# EAGLE design Avionica (EAGLE 9.6.2)
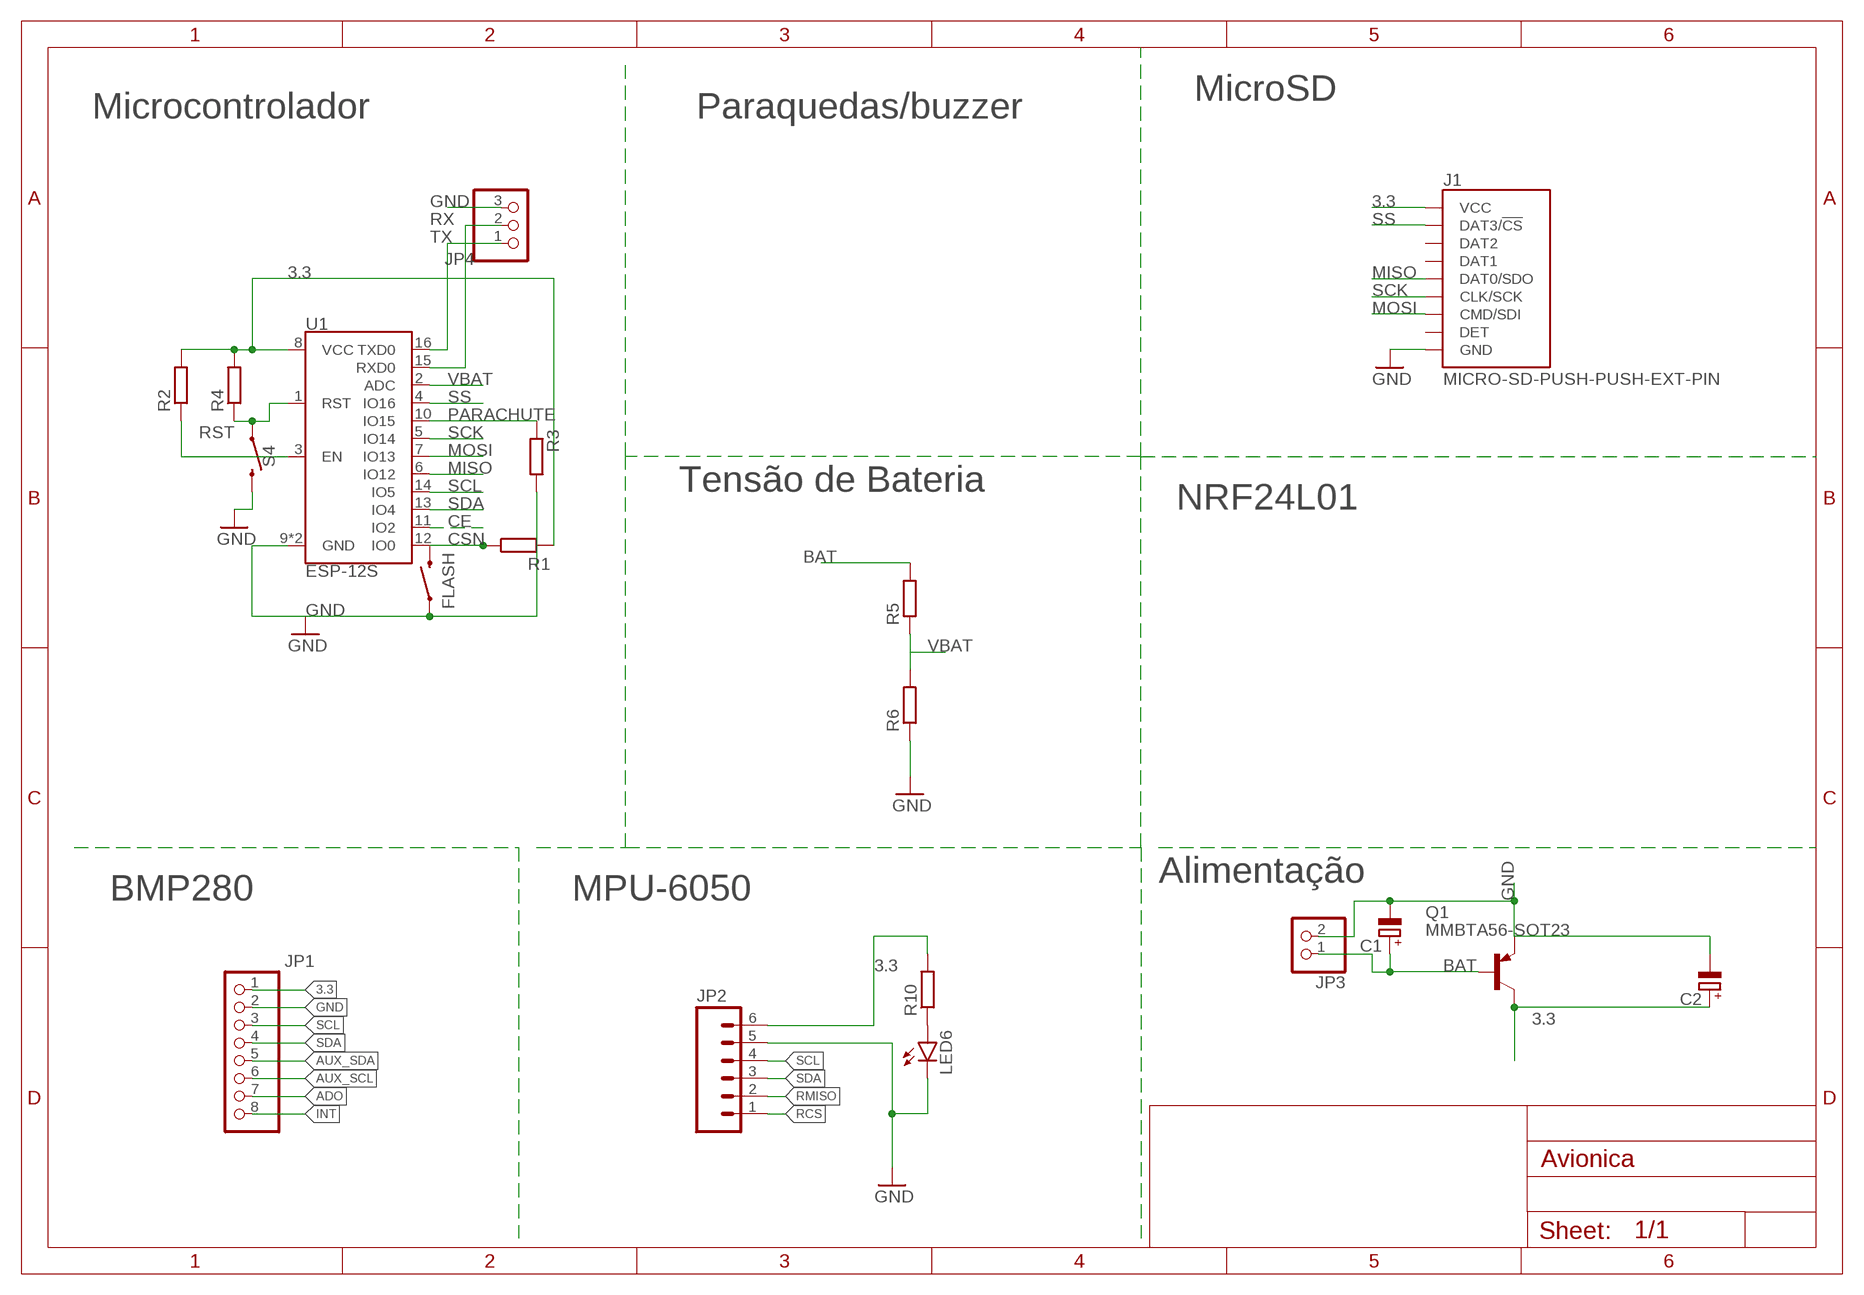
[diagram p0: schematic, sheet 1]

## Parts
C1  CPOL-EUE1.8-4  [E1,8-4]
C2  CPOL-EUE1.8-4  [E1,8-4]
FLASH  MOMENTARY-SWITCH-SPST-SMD-5.2MM-TALL  [TACTILE_SWITCH_SMD_5.2MM]
J1  MICRO-SD-PUSH-PUSH-EXT-PIN  [MICROSD-EXTERNALPIN]
JP1  PINHD-1X8  [1X08]
JP2  M06NO_SILK_FEMALE_PTH  [1X06_NO_SILK]
JP3  PINHD-1X2  [1X02]
JP4  PINHD-1X3  [1X03]
LED6  LEDCHIP-LED0805  [CHIP-LED0805]
Q1  MMBTA56-SOT23  [SOT23]
R1  R-EU_R0805W  [R0805W]
R2  R-EU_R0805W  [R0805W]
R3  R-EU_R0805W  [R0805W]
R4  R-EU_R0805W  [R0805W]
R5  R-EU_M0805  [M0805]
R6  R-EU_M0805  [M0805]
R10  R-EU_M0805  [M0805]
S4  MOMENTARY-SWITCH-SPST-SMD-5.2MM-TALL  [TACTILE_SWITCH_SMD_5.2MM]
U1  ESP-12S  [ESP-12S]

## Nets
3.3: C2.+ J1.4(VCC) JP1.1 JP2.6 Q1.3(C) R1.2 R2.2 R4.2 R10.2 U1.8(VCC)
ADO: JP1.7
AUX_SCL: JP1.6
AUX_SDA: JP1.5
BAT: C1.+ JP3.1 Q1.1(B) R5.2
CE: U1.11(IO2)
CSN: FLASH.3 R1.1 U1.12(IO0)
EN: R2.1 U1.3(EN)
GND: C1.- C2.- FLASH.1 J1.6(GND) J1.10(GND) J1.11(GND) J1.12(GND) J1.13(GND) JP1.2 JP2.5 JP3.2 JP4.3 LED6.C Q1.2(E) R3.2 R6.1 S4.3 U1.9(GND) U1.P$1(GND)
INT: JP1.8
MISO: J1.7(DAT0/SDO) U1.6(IO12)
MOSI: J1.3(CMD/SDI) U1.7(IO13)
N$16: LED6.A R10.1
PARACHUTE: R3.1 U1.10(IO15)
RCS: JP2.1
RMISO: JP2.2
RST: R4.1 S4.1 U1.1(RST)
RX: JP4.2 U1.15(RXD0)
SCK: J1.5(CLK/SCK) U1.5(IO14)
SCL: JP1.3 JP2.4 U1.14(IO5)
SDA: JP1.4 JP2.3 U1.13(IO4)
SS: J1.2(DAT3/!CS!) U1.4(IO16)
TX: JP4.1 U1.16(TXD0)
VBAT: R5.1 R6.2 U1.2(ADC)
Unconnected: J1.1(DAT2) J1.8(DAT1) J1.9(DET)

## Notes on the sheet
- MicroSD
- Microcontrolador | Paraquedas/buzzer
- Tensão de Bateria
- NRF24L01
- Alimentação
- BMP280 | MPU-6050

## Library data of the parts
C1 C2 = rcl:CPOL-EU: POLARIZED CAPACITOR, European symbol; SPICEPREFIX: C
FLASH S4 = SparkFun-Switches:MOMENTARY-SWITCH-SPST: Momentary Switch (Pushbutton) - SPST Normally-open (NO) SPST momentary switches (buttons, pushbuttons). Variants PTH-12MM - 12mm square, through-hole Momentary Pushbutton Switch - 12mm Square <https://www.sparkfun.com/products/9190> (COM-09190) PTH-6.0MM, PTH-6.0MM-KIT - 6.0mm square, through-hole Mini Pushbutton Switch <https://www.sparkfun.com/products/97> (COM-00097) KIT package intended for soldering kit's - only one side of pads' copper is exposed. PTH-RIGHT-ANGLE-KIT - Right-angle, through-hole Right Angle Tactile Button <https://www.sparkfun.com/products/10791> - Used on SparkFun BigTime Watch Kit <https://www.sparkfun.com/products/11734> SMD-12MM - 12mm square, surface-mount Tactile Button - SMD (12mm) <https://www.sparkfun.com/products/12993> (COM-12993) Used on SparkFun PicoBoard <https://www.sparkfun.com/products/11888> SMD-4.5MM - 4.5mm Square Trackball Switch Used on SparkFun Blackberry Trackballer Breakout <https://www.sparkfun.com/products/13169> SMD-4.6MMX2.8MM - 4.60mm x 2.80mm, surface mount Used on SparkFun Pro Micro - RP2040 <https://www.sparkfun.com/products/17717> SMD-5.2MM, SMD-5.2-REDUNDANT - 5.2mm square, surface-mount Mini Pushbutton Switch - SMD <https://www.sparkfun.com/products/8720> (COM-08720) Used on Arduino Pro Mini <https://www.sparkfun.com/products/11114> REDUNDANT package connects both switch circuits together SMD-6.0X3.5MM - 6.0 x 3.5mm, surface mount Momentary Reset Switch SMD <https://www.sparkfun.com/products/8229> (COM-08229) SMD-6.2MM-TALL - 6.2mm square, surface mount Tactile Button - SMD (6mm) <https://www.sparkfun.com/products/12992> Used on SparkFun Digital Sandbox <https://www.sparkfun.com/products/12651> SMD-RIGHT-ANGLE - Right-angle, surface mount Used on SparkFun Block for Intel® Edison - Arduino <https://www.sparkfun.com/products/13036>; PROD_ID: SWCH-14139
J1 = SparkFun-Connectors:MICRO-SD: microSD Socket for Transflash Various sockets for µSD. tDoc lines correctly indicate media card edge positions when inserting (unlocked, locked, depressed). NOTE: CD1 and CD2 are connected internally, and the default detect state of the socket is detect pin to ground. SparkFun Products: WAV Trigger <https://www.sparkfun.com/products/13660> CAN-Bus Shield <https://www.sparkfun.com/products/13262> SparkFun Level Shifing microSD Breakout <https://www.sparkfun.com/products/13743>; PROD_ID: CONN-16110
JP1 = pinhead:PINHD-1X8: PIN HEADER
JP2 = SparkFun-Connectors:M06: Header 6 Standard 6-pin 0.1" header. Use with straight break away headers (SKU : PRT-00116), right angle break away headers (PRT-00553), swiss pins (PRT-00743), machine pins (PRT-00117), and female headers (PRT-00115). Molex polarized connector foot print use with SKU : PRT-08094 with associated crimp pins and housings. NOTES ON THE VARIANTS LOCK and LOCK_LONGPADS... This footprint was designed to help hold the alignment of a through-hole component (i.e. 6-pin header) while soldering it into place. You may notice that each hole has been shifted either up or down by 0.005 of an inch from it's more standard position (which is a perfectly straight line). This slight alteration caused the pins (the squares in the middle) to touch the edges of the holes. Because they are alternating, it causes a "brace" to hold the component in place. 0.005 has proven to be the perfect amount of "off-center" position when using our standard breakaway headers. Although looks a little odd when you look at the bare footprint, once you have a header in there, the alteration is very hard to notice. Also,if you push a header all the way into place, it is covered up entirely on the bottom side. This idea of altering the position of holes to aid alignment will be further integrated into the Sparkfun Library for other footprints. It can help hold any component with 3 or more connection pins.; PROD_ID: CONN-08437
JP3 = pinhead:PINHD-1X2: PIN HEADER
JP4 = pinhead:PINHD-1X3: PIN HEADER
LED6 = led:LED: LED OSRAM: - CHIPLED LG R971, LG N971, LY N971, LG Q971, LY Q971, LO R971, LY R971 LH N974, LH R974 LS Q976, LO Q976, LY Q976 LO Q996 - Hyper CHIPLED LW Q18S LB Q993, LB Q99A, LB R99A - SideLED LS A670, LO A670, LY A670, LG A670, LP A670 LB A673, LV A673, LT A673, LW A673 LH A674 LY A675 LS A676, LA A676, LO A676, LY A676, LW A676 LS A679, LY A679, LG A679 - Hyper Micro SIDELED® LS Y876, LA Y876, LO Y876, LY Y876 LT Y87S - SmartLED LW L88C, LW L88S LB L89C, LB L89S, LG L890 LS L89K, LO L89K, LY L89K LS L896, LA L896, LO L896, LY L896 - TOPLED LS T670, LO T670, LY T670, LG T670, LP T670 LSG T670, LSP T670, LSY T670, LOP T670, LYG T670 LG T671, LOG T671, LSG T671 LB T673, LV T673, LT T673, LW T673 LH T674 LS T676, LA T676, LO T676, LY T676, LB T676, LH T676, LSB T676, LW T676 LB T67C, LV T67C, LT T67C, LS T67K, LO T67K, LY T67K, LW E67C LS E67B, LA E67B, LO E67B, LY E67B, LB E67C, LV E67C, LT E67C LW T67C LS T679, LY T679, LG T679 LS T770, LO T770, LY T770, LG T770, LP T770 LB T773, LV T773, LT T773, LW T773 LH T774 LS E675, LA E675, LY E675, LS T675 LS T776, LA T776, LO T776, LY T776, LB T776 LHGB T686 LT T68C, LB T68C - Hyper Mini TOPLED® LB M676 - Mini TOPLED Santana® LG M470 LS M47K, LO M47K, LY M47K Source: http://www.osram.convergy.de LUXEON: - LUMILED® LXK2-PW12-R00, LXK2-PW12-S00, LXK2-PW14-U00, LXK2-PW14-V00 LXK2-PM12-R00, LXK2-PM12-S00, LXK2-PM14-U00 LXK2-PE12-Q00, LXK2-PE12-R00, LXK2-PE12-S00, LXK2-PE14-T00, LXK2-PE14-U00 LXK2-PB12-K00, LXK2-PB12-L00, LXK2-PB12-M00, LXK2-PB14-N00, LXK2-PB14-P00, LXK2-PB14-Q00 LXK2-PR12-L00, LXK2-PR12-M00, LXK2-PR14-Q00, LXK2-PR14-R00 LXK2-PD12-Q00, LXK2-PD12-R00, LXK2-PD12-S00 LXK2-PH12-R00, LXK2-PH12-S00 LXK2-PL12-P00, LXK2-PL12-Q00, LXK2-PL12-R00 Source: www.luxeon.com KINGBRIGHT: KA-3528ASYC Source: www.kingbright.com
Q1 = transistor-pnp:*-?: PNP Transistor
R1-R6 R10 = rcl:R-EU_: RESISTOR, European symbol; SPICEPREFIX: R
U1 = SparkFun-RF:ESP-12S: AI-Thinker ESP-12S ESP-12S WiFi module is developed by AI-Thinker Co.,Ltd, core processor ESP8266 in smaller sizes of the module encapsulates Tensilica L106 integrates industry-leading ultra low power 32-bit MCU micro, with the 16-bit short mode, clock speed support 80 MHz, 160 MHz, supports the RTOS, integrated Wi-Fi MAC/BB/RF/PA/LNA, on-board antennas.; PROD_ID: IC-14115

## Board
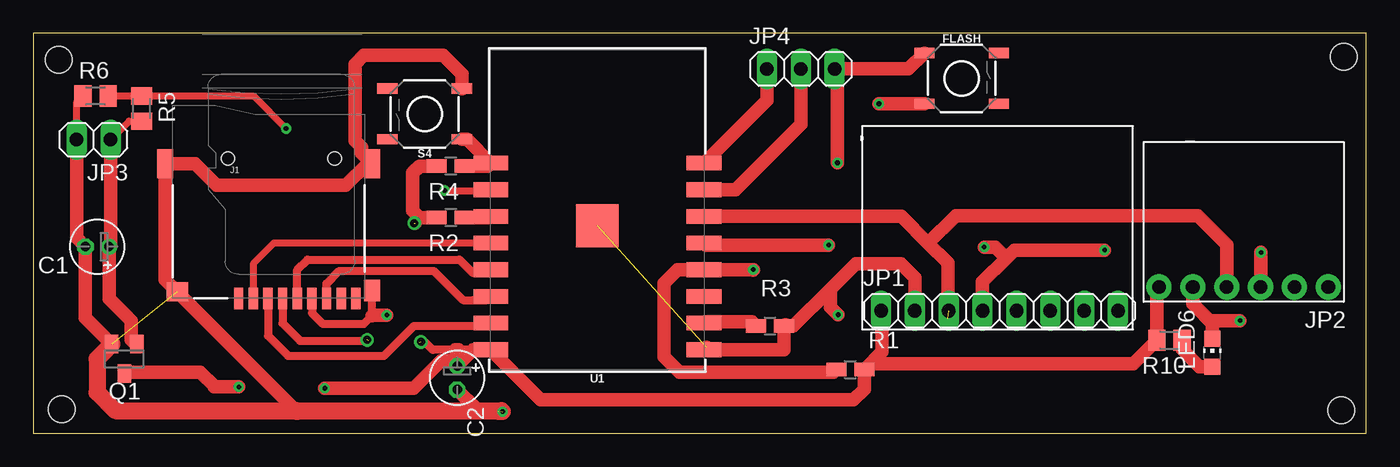
[diagram p1: board, top side]
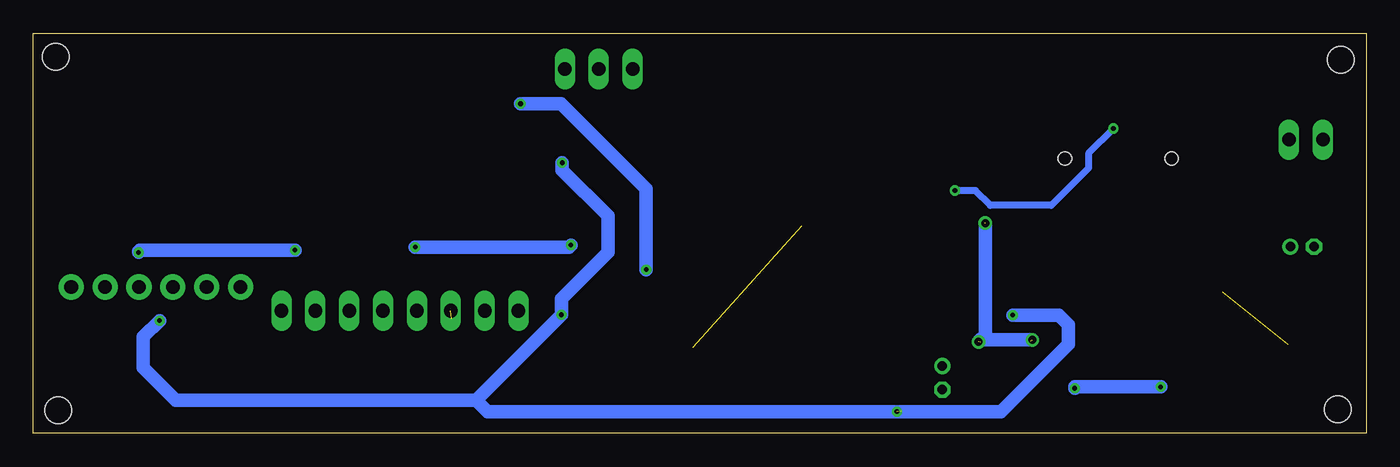
[diagram p2: board, bottom side, seen from below]

Size 100 x 30 mm. Coordinates in mm from the lower left corner, seen from the top.
Outline: 0,0 100,0 100,30 0,30 0,0
Copper layers (1*16): Top 0.035mm / dielectric 1.5mm / Bottom 0.035mm
Design rules "default": minimum track width 6mil, minimum drill 0.35mm, track to track 6mil, track to pad 6mil, pad to pad 6mil, via to via 6mil, smd to smd 6mil, copper to edge 40mil, drill to drill 6mil, minimum pad ring 10mil, minimum via ring 8mil, stop-mask expansion 4mil, vias tented up to drill 0mil, thermal gap 10mil
Holes 2 mm at 1.91,28.02 2.13,1.8 98.12,1.73 98.32,28.24

### Footprints (pad centres in the part's own frame; a part is rotated, then mirrored left to right if it is on the bottom)
E1,8-4 = drill 0.711 pad 1.168: + -0.889,0 | drill 0.711 pad 1.168 octagon: - 0.889,0
TACTILE_SWITCH_SMD_5.2MM = smd 1.524 x 0.762: 1 -2.794,1.905; 2 2.794,1.905; 3 -2.794,-1.905; 4 2.794,-1.905
MICROSD-EXTERNALPIN = smd 0.7 x 1.6: 1 2.25,10.5; 2 1.15,10.5; 3 0.05,10.5; 4 -1.05,10.5; 5 -2.15,10.5; 6 -3.25,10.5; 7 -4.35,10.5; 8 -5.45,10.5; 9 -6.55,10.5 | smd 1.2 x 1.6: 10 -7.75,9.9 | smd 1.2 x 2.2: 11 -7.75,0.4; 12 7.75,0.4 | smd 1.6 x 1.4: 13 6.85,10 | hole 1: 3.05,0; -4.95,0
1X08 = drill 1.016 long: 1 -8.89,0; 2 -6.35,0; 3 -3.81,0; 4 -1.27,0; 5 1.27,0; 6 3.81,0; 7 6.35,0; 8 8.89,0
1X06_NO_SILK = drill 1.016 pad 1.88: 1 0,0; 2 2.54,0; 3 5.08,0; 4 7.62,0; 5 10.16,0; 6 12.7,0
1X02 = drill 1.016 long: 1 -1.27,0; 2 1.27,0
1X03 = drill 1.016 long: 1 -2.54,0; 2 0,0; 3 2.54,0
CHIP-LED0805 = smd 1.2 x 1.2: A 0,-1.05; C 0,1.05
SOT23 = smd 1 x 1.4: 1 -0.95,-1.1; 2 0.95,-1.1; 3 0,1.1
R0805W = smd 1.5 x 1: 1 -1.052,0; 2 1.052,0
M0805 = smd 1.3 x 1.6: 1 -0.95,0; 2 0.95,0
ESP-12S = smd 2.6 x 1.1: 1 -8,3.5; 2 -8,1.5; 3 -8,-0.5; 4 -8,-2.5; 5 -8,-4.5; 6 -8,-6.5; 7 -8,-8.5; 8 -8,-10.5; 9 8,-10.5; 10 8,-8.5; 11 8,-6.5; 12 8,-4.5; 13 8,-2.5; 14 8,-0.5; 15 8,1.5; 16 8,3.5 | smd 3.2 x 3.2: P$1 0,-1.2

### Placement (x,y rotation side)
C1  4.8,14 180 top
C2  31.8,4.17 270 top
FLASH  69.65,26.62 0 top
J1  17.65,20.62 180 top
JP1  72.49,9.19 0 top
JP2  97.16,10.97 180 top
JP3  4.52,22.02 180 top
JP4  57.58,27.33 0 top
LED6  88.44,6.05 0 top
Q1  6.83,5.59 180 top
R1  61.29,4.78 0 top
R2  31.32,16.18 180 top
R3  55.27,8.05 0 top
R4  31.32,20.04 180 top
R5  8.13,24.36 270 top
R6  4.67,25.3 0 top
R10  85.24,6.99 180 top
S4  29.36,23.95 180 top
U1  42.32,16.76 0 top

### Tracks (layer width: path | path; a pad name or v marks a point on that pad's centre or on a via)
3.3  (via drill 0.35, 0.6)  (3 unrouted)
  Top 0.61: U1.8 31.9,6.26 | 31.65,6.26 29.96,6.26 29.39,6.83 28.96,6.83 | J1.4 18.7,8.25 20.02,6.93 25.15,6.93
  Top 1.016: R2.2 28.98,16.18 | 28.98,16.18 28.47,16.69 28.47,19.53 28.98,20.04 R4.2 | 28.98,16.18 28.63,15.82 28.63,15.77 | Q1.3 6.93,4.59 12.53,4.59 13.56,3.56 13.56,3.48 v15.42,3.48 | v21.87,3.38 28.52,3.38 30.58,5.44 31.42,5.44 C2.+ 33.01,6.26 U1.8 38.07,2.52 61.54,2.52 62.34,3.31 R1.2 | 31.65,6.26 31.9,6.26 | JP2.6 84.29,10.81 R10.2 82.54,5.23 62.8,5.23 R1.2 | R1.2 63.68,6.11 63.68,9.12 JP1.1
  Bottom 1.016: v15.42,3.48 21.87,3.48 v21.87,3.38 | v28.57,15.77 28.57,7.37 v29.08,6.86 28.93,7.01 v25.04,7.01
BAT
  Top 0.508: JP3.1 7.18,23.41 R5.2
  Top 1.016: JP3.1 5.79,14.1 C1.+ 5.69,10.08 7.34,8.43 7.34,7.03 7.69,6.69 Q1.1
CSN  (via drill 0.35)
  Top 1.016: R1.1 60.03,4.57 48.49,4.57 47.32,5.74 47.32,11.25 48.33,12.26 U1.12 53.95,12.26 53.98,12.24 v54.01,12.28 | v63.45,24.71 FLASH.3
  Bottom 1.016: v54.01,12.28 54.01,18.33 60.4,24.71 v63.45,24.71
EN
  Top 1.016: R2.1 34.23,16.18 U1.3
GND  (via drill 0.35)  (3 unrouted)
  Top 0.508: JP3.2 3.25,24.83 R6.1
  Top 0.61: J1.6 20.9,9.02 21.72,8.2 24.79,8.2 25.4,8.82 J1.10
  Top 1.016: 50.52,6.47 U1.9 56.32,6.26 R3.2 | 19.8,1.63 J1.13 9.9,11.53 J1.12 | J1.12 12.14,20.23 13.77,18.6 23.44,18.6 25.07,20.23 J1.11 24.63,21 24.63,21.46 24.13,21.96 24.13,27.69 24.79,28.35 30.73,28.35 32.16,26.92 S4.3 | JP4.3 61.04,27.33 | C2.- 33.17,1.91 | 33.17,1.91 33.17,1.63 | JP3.2 3.25,14.66 C1.- 3.91,8.66 Q1.2 | 9.98,20.3 J1.12 | R3.2 56.42,8.15 | LED6.C 88.44,8.26 87.35,9.35 | JP2.5 87,9.7 87.35,9.35 | JP1.2 66.14,11.68 65.1,12.72 61.72,12.72 59.8,10.81 | R3.2 57.05,8.05 59.8,10.81 | 59.8,10.81 59.8,9.46 v60.38,8.89 | v60.33,20.3 60.33,27.13 JP4.3 | FLASH.1 65.66,27.33 JP4.3 | v90.53,8.46 88.24,8.46 87.35,9.35 | 33.17,1.91 33.45,1.63 34.87,1.63 v35.2,1.63 | 25.4,8.82 25.45,8.87 v26.52,8.87
  Top 1.27: Q1.2 4.78,5.58 4.78,3.07 6.15,1.7 19.73,1.7 | 19.73,1.7 19.78,1.65 | 19.78,1.65 19.8,1.65 19.78,1.65 | 19.73,1.7 35.13,1.7 35.18,1.65 35.2,1.65 34.87,1.65 | 19.73,1.7 19.78,1.65
  Bottom 1.016: v60.33,20.3 60.33,19.74 56.9,16.31 56.9,13.59 60.38,10.11 v60.38,8.89 66.78,2.49 | 66.78,2.49 89.31,2.49 91.75,4.93 91.75,7.24 v90.53,8.46 | 66.78,2.49 65.91,1.63 v35.2,1.63 27.41,1.63 22.35,6.68 22.35,8.15 23.06,8.87 v26.52,8.87
MISO
  Top 0.508: U1.6 34.03,9.98 32.99,9.98
  Top 0.61: J1.7 22,11.23 22.96,12.19 30.02,12.19 32.23,9.98 32.99,9.98 34.03,9.98
MOSI
  Top 0.508: U1.7 34.11,8.06 32.08,8.06
  Top 0.61: J1.3 17.6,7.31 19.1,5.82 26.31,5.82 28.55,8.06 32.08,8.06 34.11,8.06
N$16
  Top 1.016: R10.1 86.19,6.29 87.49,5 LED6.A
PARACHUTE
  Top 1.016: R3.1 53.91,8.36 50.41,8.36 U1.10
RST
  Top 1.016: R4.1 34.09,20.04 U1.1 32.53,22.05 S4.1
RX
  Top 1.016: 57.58,24.75 JP4.2 57.58,23.16 52.68,18.26 U1.15
SCK
  Top 0.508: U1.5 34.09,12.04 32.97,12.04
  Top 0.61: J1.5 19.8,12.26 20.57,13.03 31.98,13.03 32.97,12.04
SCL  (1 unrouted)
  Top 1.016: U1.14 65.12,16.26 67.13,14.25 | 68.61,8.61 68.61,12.78 67.13,14.25 | JP2.4 89.53,14.15 87.35,16.33 69.22,16.33 67.13,14.25
SDA  (via drill 0.35)
  Top 1.016: U1.13 50.39,14.34 | U1.13 50.37,14.21 | JP1.4 71.22,11.35 73.01,13.14 | v80.37,13.74 73.61,13.74 73.01,13.14 | v92.1,13.56 92.1,11 JP2.3 | 73.01,13.14 72.19,13.97 v71.35,13.97 | v59.66,14.12 50.46,14.12 U1.13
  Bottom 1.016: v80.37,13.74 92.02,13.74 92.1,13.66 v92.1,13.56 | v71.35,13.97 59.82,13.97 v59.66,14.12
SS
  Top 0.508: U1.4 18.05,14.26 16.5,12.72 J1.2
TX
  Top 1.016: U1.16 55.04,24.99 JP4.1
VBAT  (via drill 0.35)
  Top 0.508: R6.2 5.63,25.31 R5.1 16.52,25.31 v18.97,22.86 | v30.86,18.21 34.26,18.21 U1.2
  Bottom 0.508: v18.97,22.86 20.83,21 20.83,19.89 23.63,17.09 28.19,17.09 29.31,18.21 v30.86,18.21